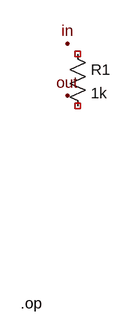
[diagram p0: schematic spec_case.asc]
spec_case.asc, the LTspice schematic file:
Version 4
SHEET 1 880 680
FLAG 120 160 in
FLAG 120 240 out
SYMBOL res 120 160 R0
SYMATTR InstName R1
SYMATTR Value 1k
TEXT 48 560 Left 2 !.op

The netlist it stands for:
* spec_case.asc
R1 NC_01 NC_02 1k
.op
.backanno
.end